# EAGLE schematic Rev1 (EAGLE 7.7.0)
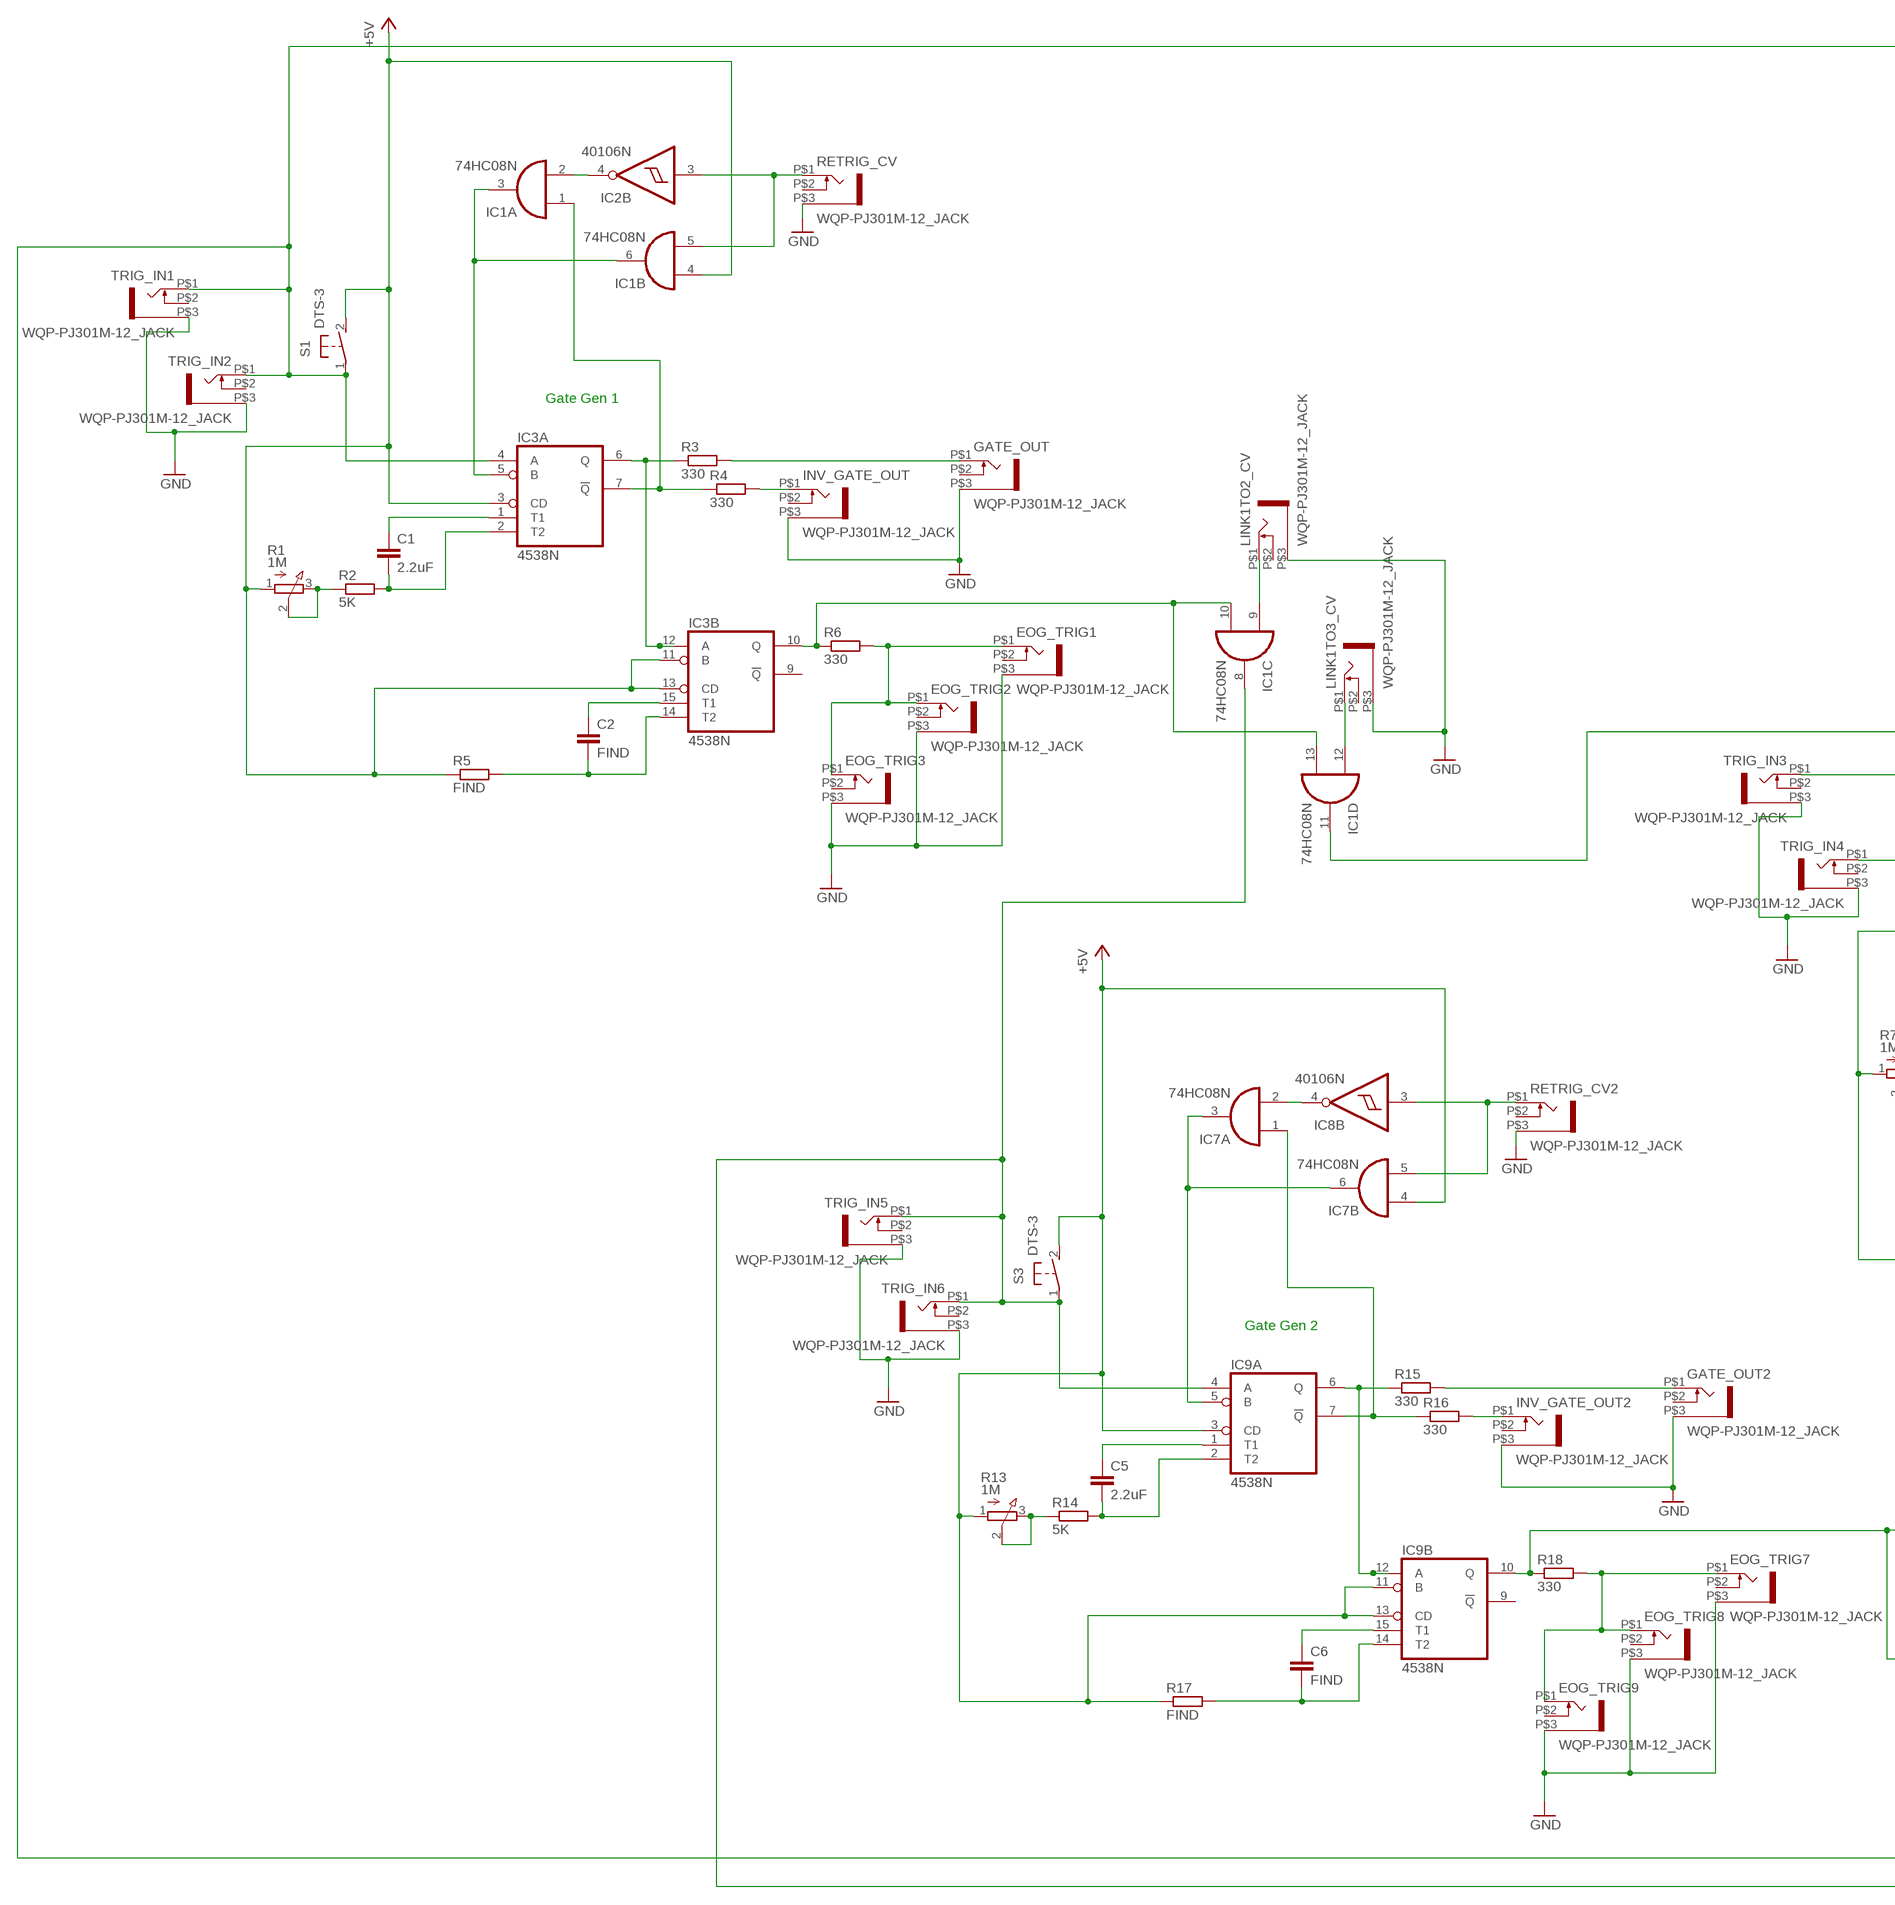
[diagram p0: schematic, sheet 1, part 1 of 2]
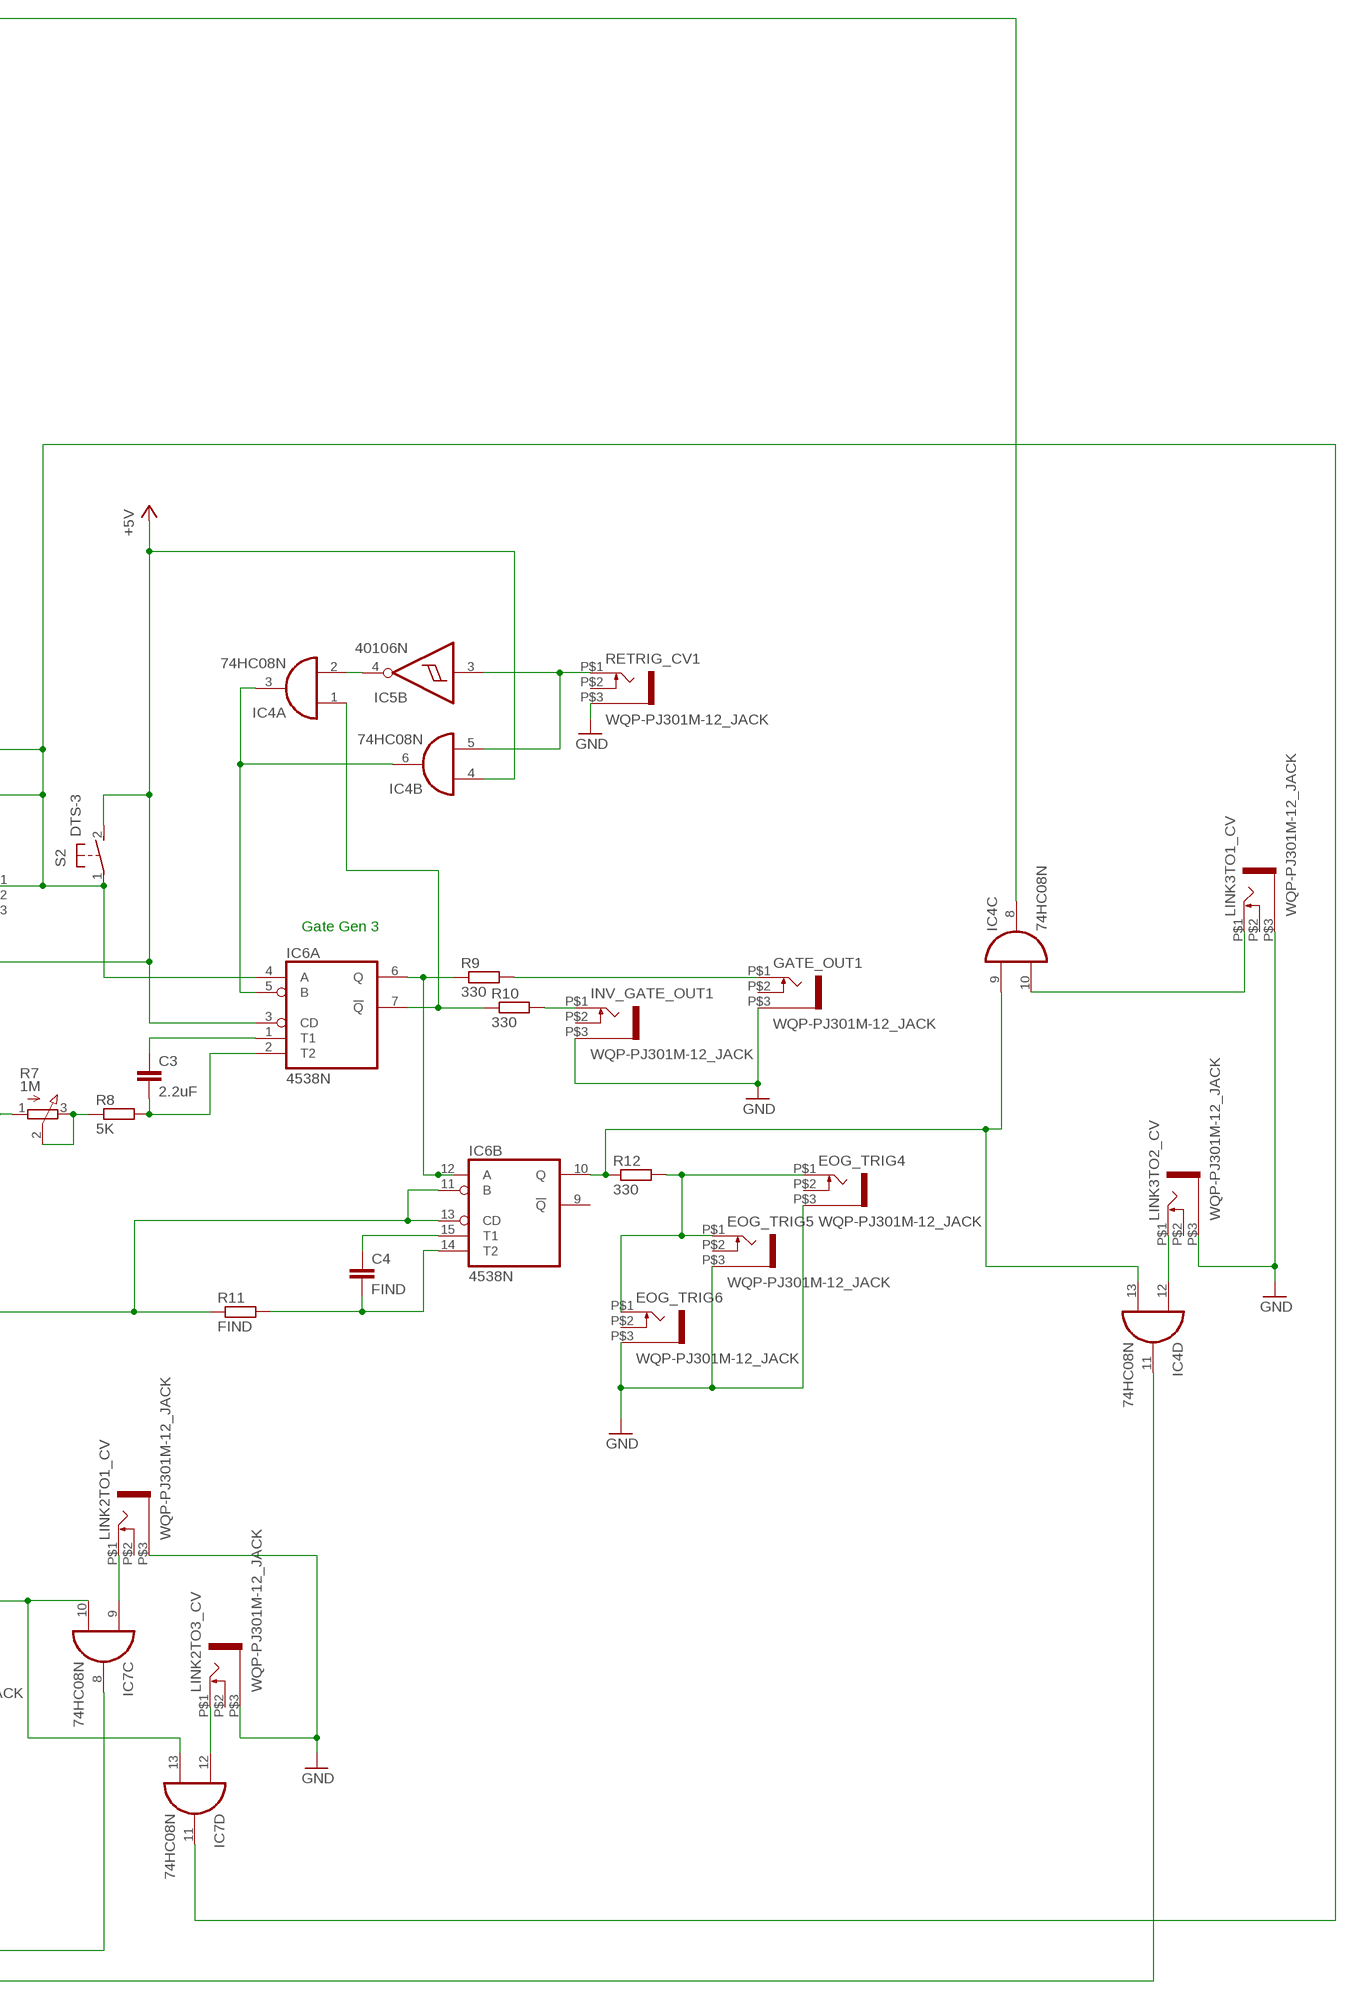
[diagram p1: schematic, sheet 1, part 2 of 2]

## Parts
C1  2.2uF  C2,5-3  [C2.5-3]
C2  FIND  C2,5-3  [C2.5-3]
C3  2.2uF  C2,5-3  [C2.5-3]
C4  FIND  C2,5-3  [C2.5-3]
C5  2.2uF  C2,5-3  [C2.5-3]
C6  FIND  C2,5-3  [C2.5-3]
EOG_TRIG1  WQP-PJ301M-12_JACK  [WQP-PJ301M-12_JACK]
EOG_TRIG2  WQP-PJ301M-12_JACK  [WQP-PJ301M-12_JACK]
EOG_TRIG3  WQP-PJ301M-12_JACK  [WQP-PJ301M-12_JACK]
EOG_TRIG4  WQP-PJ301M-12_JACK  [WQP-PJ301M-12_JACK]
EOG_TRIG5  WQP-PJ301M-12_JACK  [WQP-PJ301M-12_JACK]
EOG_TRIG6  WQP-PJ301M-12_JACK  [WQP-PJ301M-12_JACK]
EOG_TRIG7  WQP-PJ301M-12_JACK  [WQP-PJ301M-12_JACK]
EOG_TRIG8  WQP-PJ301M-12_JACK  [WQP-PJ301M-12_JACK]
EOG_TRIG9  WQP-PJ301M-12_JACK  [WQP-PJ301M-12_JACK]
GATE_OUT  WQP-PJ301M-12_JACK  [WQP-PJ301M-12_JACK]
GATE_OUT1  WQP-PJ301M-12_JACK  [WQP-PJ301M-12_JACK]
GATE_OUT2  WQP-PJ301M-12_JACK  [WQP-PJ301M-12_JACK]
IC1  74HC08N  [DIL14]
IC2  40106N  [DIL14]
IC3  4538N  [DIL16]
IC4  74HC08N  [DIL14]
IC5  40106N  [DIL14]
IC6  4538N  [DIL16]
IC7  74HC08N  [DIL14]
IC8  40106N  [DIL14]
IC9  4538N  [DIL16]
INV_GATE_OUT  WQP-PJ301M-12_JACK  [WQP-PJ301M-12_JACK]
INV_GATE_OUT1  WQP-PJ301M-12_JACK  [WQP-PJ301M-12_JACK]
INV_GATE_OUT2  WQP-PJ301M-12_JACK  [WQP-PJ301M-12_JACK]
LINK1TO2_CV  WQP-PJ301M-12_JACK  [WQP-PJ301M-12_JACK]
LINK1TO3_CV  WQP-PJ301M-12_JACK  [WQP-PJ301M-12_JACK]
LINK2TO1_CV  WQP-PJ301M-12_JACK  [WQP-PJ301M-12_JACK]
LINK2TO3_CV  WQP-PJ301M-12_JACK  [WQP-PJ301M-12_JACK]
LINK3TO1_CV  WQP-PJ301M-12_JACK  [WQP-PJ301M-12_JACK]
LINK3TO2_CV  WQP-PJ301M-12_JACK  [WQP-PJ301M-12_JACK]
R1  1M  3RP/1610N  [3RP/1610N]
R2  5K  R-EU_0204/2V  [0204V]
R3  330  R-EU_0204/2V  [0204V]
R4  330  R-EU_0204/2V  [0204V]
R5  FIND  R-EU_0204/2V  [0204V]
R6  330  R-EU_0204/2V  [0204V]
R7  1M  3RP/1610N  [3RP/1610N]
R8  5K  R-EU_0204/2V  [0204V]
R9  330  R-EU_0204/2V  [0204V]
R10  330  R-EU_0204/2V  [0204V]
R11  FIND  R-EU_0204/2V  [0204V]
R12  330  R-EU_0204/2V  [0204V]
R13  1M  3RP/1610N  [3RP/1610N]
R14  5K  R-EU_0204/2V  [0204V]
R15  330  R-EU_0204/2V  [0204V]
R16  330  R-EU_0204/2V  [0204V]
R17  FIND  R-EU_0204/2V  [0204V]
R18  330  R-EU_0204/2V  [0204V]
RETRIG_CV  WQP-PJ301M-12_JACK  [WQP-PJ301M-12_JACK]
RETRIG_CV1  WQP-PJ301M-12_JACK  [WQP-PJ301M-12_JACK]
RETRIG_CV2  WQP-PJ301M-12_JACK  [WQP-PJ301M-12_JACK]
S1  DTS-3  [DTS-3]
S2  DTS-3  [DTS-3]
S3  DTS-3  [DTS-3]
TRIG_IN1  WQP-PJ301M-12_JACK  [WQP-PJ301M-12_JACK]
TRIG_IN2  WQP-PJ301M-12_JACK  [WQP-PJ301M-12_JACK]
TRIG_IN3  WQP-PJ301M-12_JACK  [WQP-PJ301M-12_JACK]
TRIG_IN4  WQP-PJ301M-12_JACK  [WQP-PJ301M-12_JACK]
TRIG_IN5  WQP-PJ301M-12_JACK  [WQP-PJ301M-12_JACK]
TRIG_IN6  WQP-PJ301M-12_JACK  [WQP-PJ301M-12_JACK]

## Nets
+5V: IC1.4(B:I0) IC3.3(A:CD) IC3.11(B:B) IC3.13(B:CD) IC4.4(B:I0) IC6.3(A:CD) IC6.11(B:B) IC6.13(B:CD) IC7.4(B:I0) IC9.3(A:CD) IC9.11(B:B) IC9.13(B:CD) R1.1(A) R5.1 R7.1(A) R11.1 R13.1(A) R17.1 S1.2 S2.2 S3.2
GND: EOG_TRIG1.P$3 EOG_TRIG2.P$3 EOG_TRIG3.P$3 EOG_TRIG4.P$3 EOG_TRIG5.P$3 EOG_TRIG6.P$3 EOG_TRIG7.P$3 EOG_TRIG8.P$3 EOG_TRIG9.P$3 GATE_OUT1.P$3 GATE_OUT2.P$3 GATE_OUT.P$3 INV_GATE_OUT1.P$3 INV_GATE_OUT2.P$3 INV_GATE_OUT.P$3 LINK1TO2_CV.P$3 LINK1TO3_CV.P$3 LINK2TO1_CV.P$3 LINK2TO3_CV.P$3 LINK3TO1_CV.P$3 LINK3TO2_CV.P$3 RETRIG_CV1.P$3 RETRIG_CV2.P$3 RETRIG_CV.P$3 TRIG_IN1.P$3 TRIG_IN2.P$3 TRIG_IN3.P$3 TRIG_IN4.P$3 TRIG_IN5.P$3 TRIG_IN6.P$3
N$1: C1.1 IC3.1(A:T1)
N$2: C1.2 IC3.2(A:T2) R2.2
N$3: R1.2(S) R1.3(E) R2.1
N$4: IC1.3(A:O) IC1.6(B:O) IC3.5(A:B)
N$5: IC1.1(A:I0) IC3.7(A:!Q) R4.1
N$6: IC3.6(A:Q) IC3.12(B:A) R3.1
N$7: GATE_OUT.P$1 R3.2
N$8: IC3.4(A:A) IC4.8(C:O) IC7.8(C:O) S1.1 TRIG_IN1.P$1 TRIG_IN2.P$1
N$9: INV_GATE_OUT.P$1 R4.2
N$10: IC1.5(B:I1) IC2.3(B:I) RETRIG_CV.P$1
N$11: IC1.2(A:I1) IC2.4(B:O)
N$12: C2.1 IC3.15(B:T1)
N$13: C2.2 IC3.14(B:T2) R5.2
N$14: IC1.10(C:I1) IC1.13(D:I1) IC3.10(B:Q) R6.1
N$15: IC1.9(C:I0) LINK1TO2_CV.P$1
N$16: EOG_TRIG1.P$1 EOG_TRIG2.P$1 EOG_TRIG3.P$1 R6.2
N$17: IC1.12(D:I0) LINK1TO3_CV.P$1
N$18: C3.1 IC6.1(A:T1)
N$19: C3.2 IC6.2(A:T2) R8.2
N$20: R7.2(S) R7.3(E) R8.1
N$21: IC4.3(A:O) IC4.6(B:O) IC6.5(A:B)
N$22: IC4.1(A:I0) IC6.7(A:!Q) R10.1
N$23: IC6.6(A:Q) IC6.12(B:A) R9.1
N$24: IC1.11(D:O) IC6.4(A:A) IC7.11(D:O) S2.1 TRIG_IN3.P$1 TRIG_IN4.P$1
N$25: GATE_OUT1.P$1 R9.2
N$26: IC4.5(B:I1) IC5.3(B:I) RETRIG_CV1.P$1
N$27: IC4.2(A:I1) IC5.4(B:O)
N$28: INV_GATE_OUT1.P$1 R10.2
N$29: C4.1 IC6.15(B:T1)
N$30: C4.2 IC6.14(B:T2) R11.2
N$31: IC4.9(C:I0) IC4.13(D:I1) IC6.10(B:Q) R12.1
N$32: EOG_TRIG4.P$1 EOG_TRIG5.P$1 EOG_TRIG6.P$1 R12.2
N$34: IC4.12(D:I0) LINK3TO2_CV.P$1
N$35: C5.1 IC9.1(A:T1)
N$36: C5.2 IC9.2(A:T2) R14.2
N$37: R13.2(S) R13.3(E) R14.1
N$38: IC7.3(A:O) IC7.6(B:O) IC9.5(A:B)
N$39: IC7.1(A:I0) IC9.7(A:!Q) R16.1
N$40: IC9.6(A:Q) IC9.12(B:A) R15.1
N$41: IC1.8(C:O) IC4.11(D:O) IC9.4(A:A) S3.1 TRIG_IN5.P$1 TRIG_IN6.P$1
N$42: GATE_OUT2.P$1 R15.2
N$43: IC7.5(B:I1) IC8.3(B:I) RETRIG_CV2.P$1
N$44: IC7.2(A:I1) IC8.4(B:O)
N$45: INV_GATE_OUT2.P$1 R16.2
N$46: C6.1 IC9.15(B:T1)
N$47: C6.2 IC9.14(B:T2) R17.2
N$48: IC7.10(C:I1) IC7.13(D:I1) IC9.10(B:Q) R18.1
N$49: EOG_TRIG7.P$1 EOG_TRIG8.P$1 EOG_TRIG9.P$1 R18.2
N$50: IC7.9(C:I0) LINK2TO1_CV.P$1
N$51: IC7.12(D:I0) LINK2TO3_CV.P$1
N$52: IC4.10(C:I1) LINK3TO1_CV.P$1
Unconnected: EOG_TRIG1.P$2 EOG_TRIG2.P$2 EOG_TRIG3.P$2 EOG_TRIG4.P$2 EOG_TRIG5.P$2 EOG_TRIG6.P$2 EOG_TRIG7.P$2 EOG_TRIG8.P$2 EOG_TRIG9.P$2 GATE_OUT1.P$2 GATE_OUT2.P$2 GATE_OUT.P$2 IC2.1(A:I) IC2.2(A:O) IC2.5(C:I) IC2.6(C:O) IC2.8(D:O) IC2.9(D:I) IC2.10(E:O) IC2.11(E:I) IC2.12(F:O) IC2.13(F:I) IC3.9(B:!Q) IC5.1(A:I) IC5.2(A:O) IC5.5(C:I) IC5.6(C:O) IC5.8(D:O) IC5.9(D:I) IC5.10(E:O) IC5.11(E:I) IC5.12(F:O) IC5.13(F:I) IC6.9(B:!Q) IC8.1(A:I) IC8.2(A:O) IC8.5(C:I) IC8.6(C:O) IC8.8(D:O) IC8.9(D:I) IC8.10(E:O) IC8.11(E:I) IC8.12(F:O) IC8.13(F:I) IC9.9(B:!Q) INV_GATE_OUT1.P$2 INV_GATE_OUT2.P$2 INV_GATE_OUT.P$2 LINK1TO2_CV.P$2 LINK1TO3_CV.P$2 LINK2TO1_CV.P$2 LINK2TO3_CV.P$2 LINK3TO1_CV.P$2 LINK3TO2_CV.P$2 RETRIG_CV1.P$2 RETRIG_CV2.P$2 RETRIG_CV.P$2 TRIG_IN1.P$2 TRIG_IN2.P$2 TRIG_IN3.P$2 TRIG_IN4.P$2 TRIG_IN5.P$2 TRIG_IN6.P$2

## Notes on the sheet
- Gate Gen 1
- Gate Gen 3
- Gate Gen 2

## Power pins joined to a net without a drawn wire
GND: IC1.7(P:GND) IC4.7(P:GND) IC7.7(P:GND)
VCC: IC1.14(P:VCC) IC4.14(P:VCC) IC7.14(P:VCC)
VDD: IC2.14(P:VDD) IC3.16(P:VDD) IC5.14(P:VDD) IC6.16(P:VDD) IC8.14(P:VDD) IC9.16(P:VDD)
VSS: IC2.7(P:VSS) IC3.8(P:VSS) IC5.7(P:VSS) IC6.8(P:VSS) IC8.7(P:VSS) IC9.8(P:VSS)

## Library data of the parts
C1-C6 = capacitor-wima:C: CAPACITOR naming: grid - package width
EOG_TRIG1-EOG_TRIG9 GATE_OUT GATE_OUT1 GATE_OUT2 INV_GATE_OUT INV_GATE_OUT1 INV_GATE_OUT2 LINK1TO2_CV LINK1TO3_CV LINK2TO1_CV LINK2TO3_CV LINK3TO1_CV LINK3TO2_CV RETRIG_CV RETRIG_CV1 RETRIG_CV2 TRIG_IN1-TRIG_IN6 = thonkiconn:WQP-PJ301M-12_JACK
IC1 IC4 IC7 = 74xx-eu:74*08: Quad 2-input AND gate
IC2 IC5 IC8 = 40xx:40106: Hex SCHMITT TRIGGER
IC3 IC6 IC9 = 45xx:4538: Dual precision monostable MULTIVIBRATOR
R1 R7 R13 = pot:3RP/1610N: 16mm Potentiometer one level Source: http://www.alphapotentiometers.net/html/16mm_pot_2.html
R2-R6 R8-R12 R14-R18 = resistor:R-EU_: RESISTOR, European symbol
S1-S3 = switch-tact:DTS-3